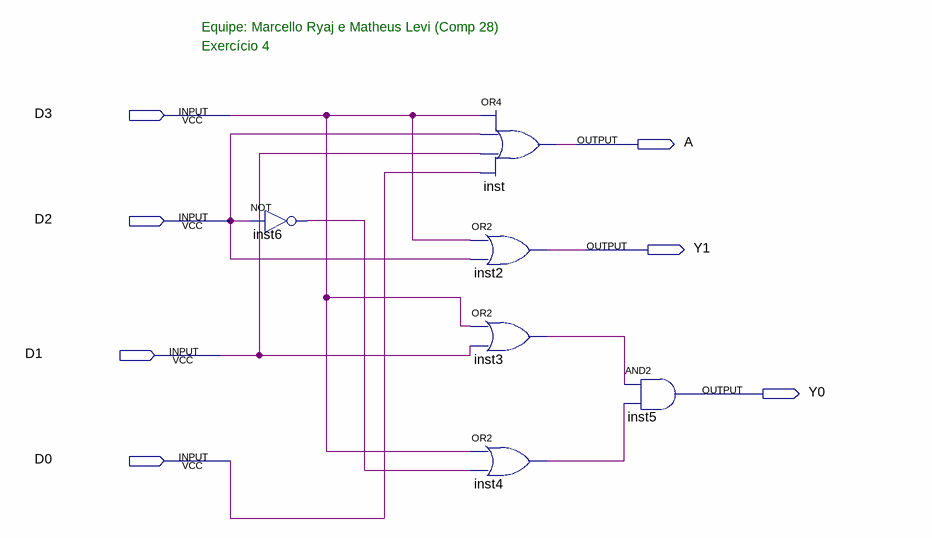
[diagram p0: schematic sheet]
// Quartus schematic exercicio4.bdf as structural Verilog: 6 symbols, 7 pins
module exercicio4 (
  input  D3,
  input  D2,
  input  D1,
  input  D0,
  output A,
  output Y1,
  output Y0
);

  wire inst3_out, inst4_out, inst6_out;

  not inst6 (inst6_out, D2);
  or inst (A, D3, D2, D1, D0);
  or inst2 (Y1, D3, D2);
  or inst3 (inst3_out, D3, D1);
  or inst4 (inst4_out, D3, inst6_out);
  and inst5 (Y0, inst3_out, inst4_out);

  // Notes on the sheet:
  //   Equipe: Marcello Ryaj e Matheus Levi (Comp 28)
  //   Exercício 4
endmodule
